# EAGLE schematic Main_Board (EAGLE 9.7.0)
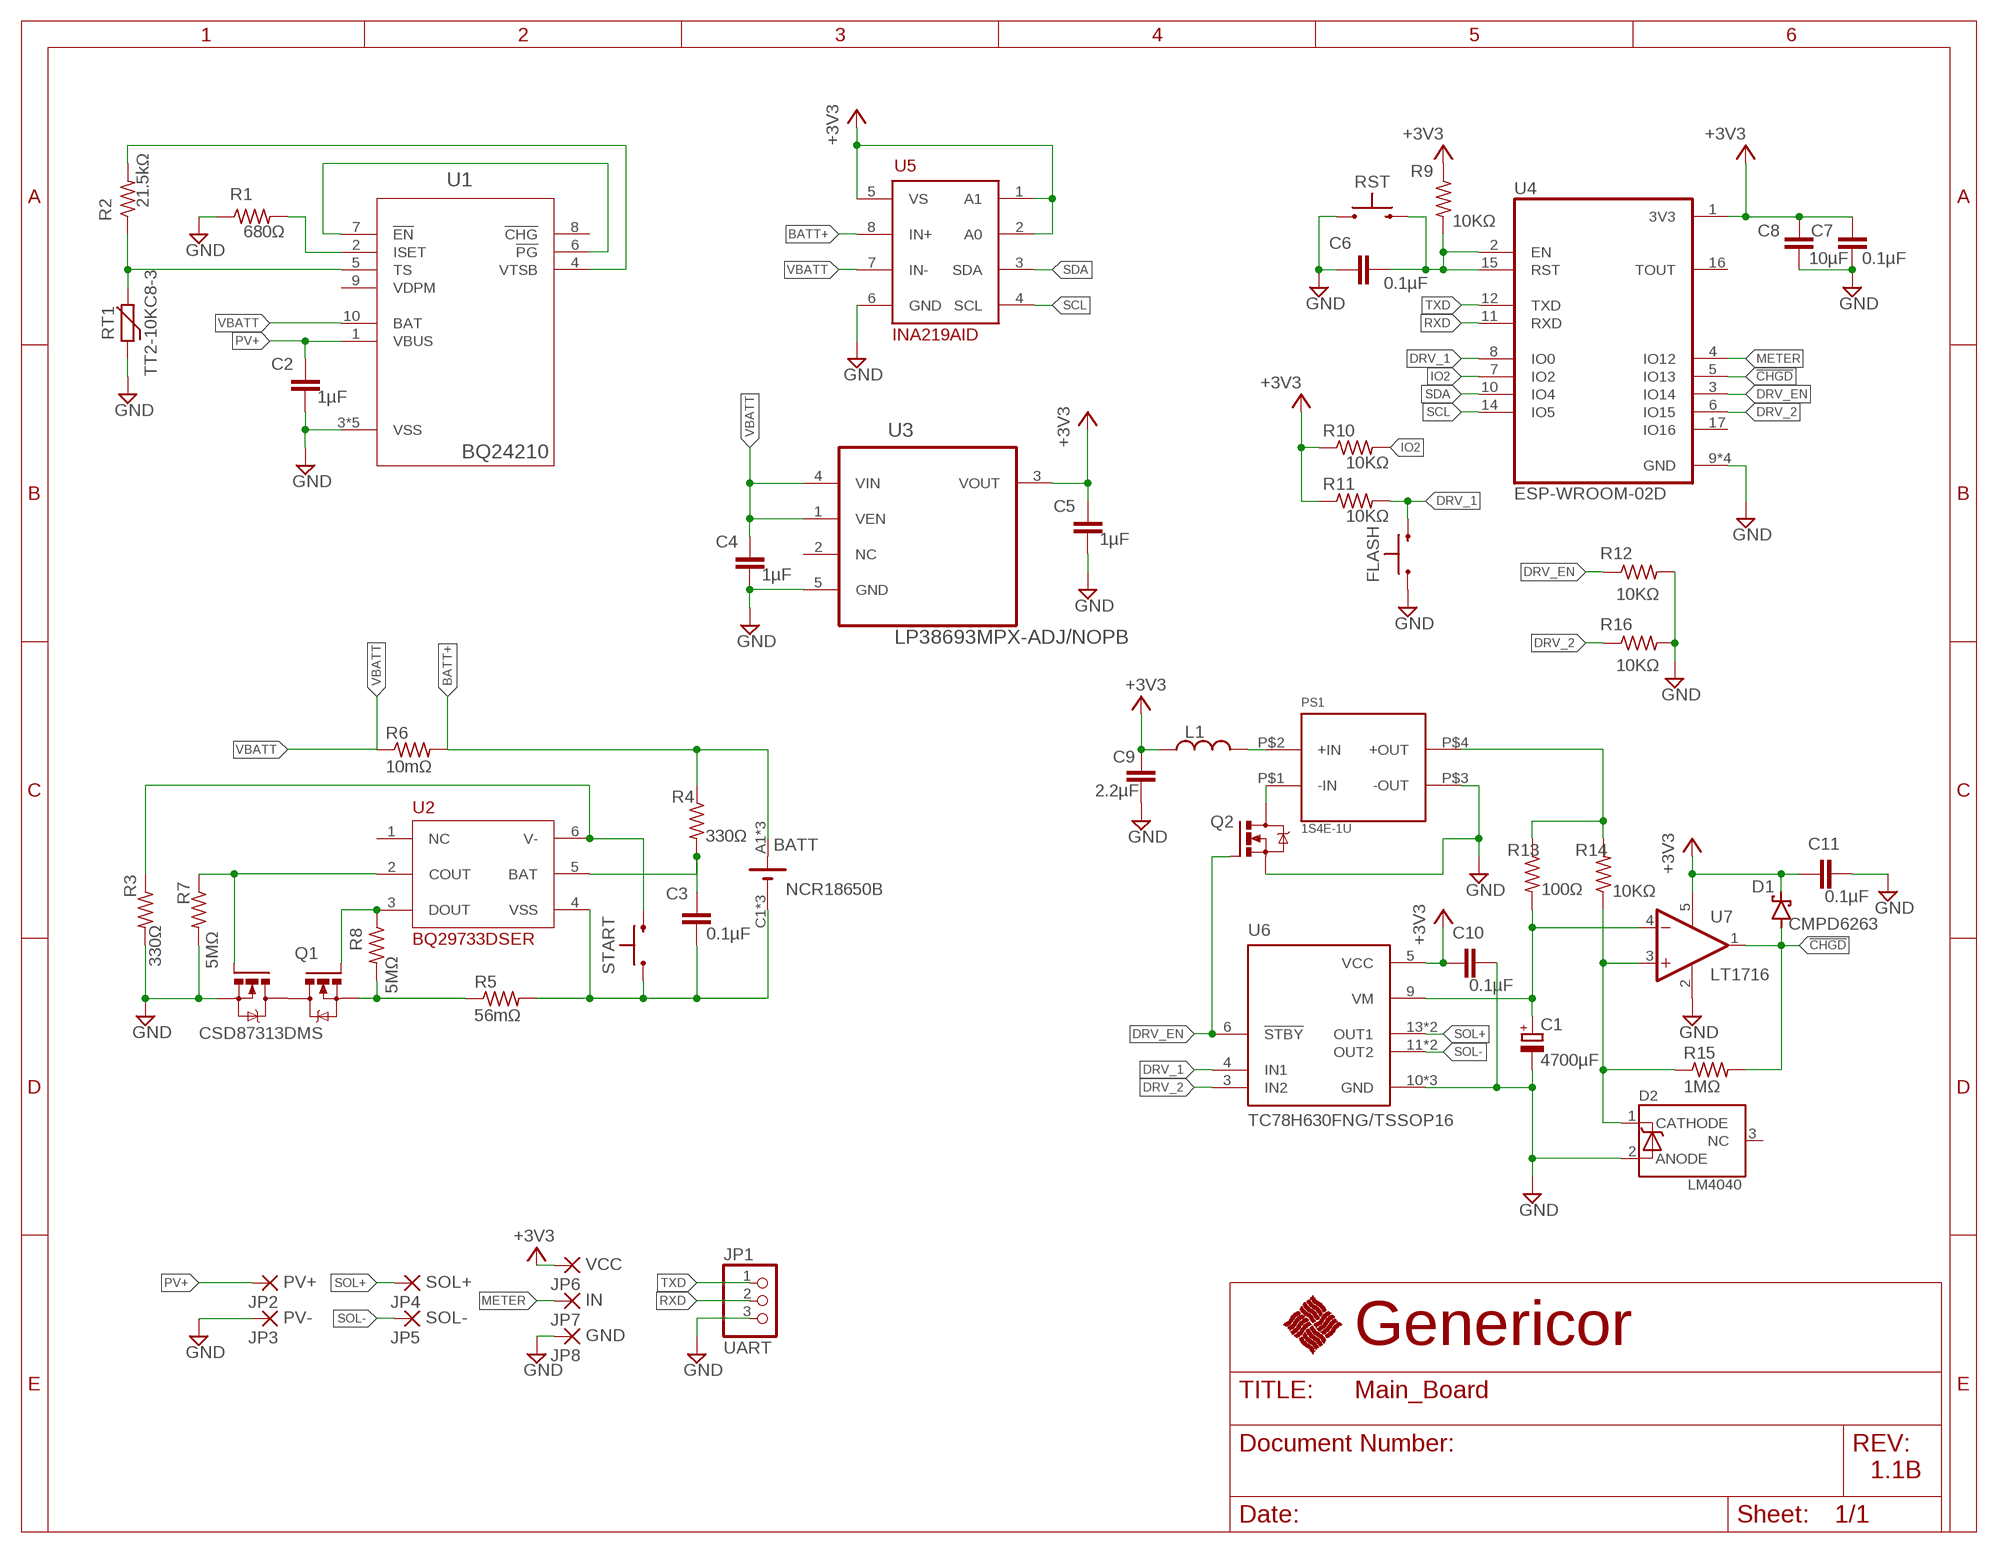
[diagram p0: schematic, sheet 1]

## Parts
BATT  NCR18650B  [18650-65MM-54-PTH]
C1  4700µF  CPOL-7.62-18-27  [E7,5-18]
C2  1µF  C-EUC0402  [C0402]
C3  0.1µF  C-EUC0402  [C0402]
C4  1µF  C-EUC0402  [C0402]
C5  1µF  C-EUC0402  [C0402]
C6  0.1µF  C-EUC0402  [C0402]
C7  0.1µF  C-EUC0402  [C0402]
C8  10µF  C-EUC0805  [C0805]
C9  2.2µF  C-EUC1210  [C1210]
C10  0.1µF  C-EUC0402  [C0402]
C11  0.1µF  C-EUC0402  [C0402]
D1  CMPD6263  [SOT95P227X109-3N]
D2  LM4040LM4040CIM3-8.2  [SOT95P240X110-3N]
FLASH  PTS636_SL43_SMTR_LFS  [S_43]
JP1  UART  PINHD-1X3  [1X03]
JP2  PV+  WIREPAD2,54/1,1  [2,54/1,1]
JP3  PV-  WIREPAD2,54/1,1  [2,54/1,1]
JP4  SOL+  WIREPAD2,54/1,1  [2,54/1,1]
JP5  SOL-  WIREPAD2,54/1,1  [2,54/1,1]
JP6  VCC  WIREPAD2,54/1,1  [2,54/1,1]
JP7  IN  WIREPAD2,54/1,1  [2,54/1,1]
JP8  GND  WIREPAD2,54/1,1  [2,54/1,1]
L1  ASPI-6045S-180M-T  [INDM6060X450N]
PS1  1S4E-1U  [1S4E_S1U-DIP4]
Q1  CSD87313DMS  [DMS0008A]
Q2  CSD16406Q3  [DQG0008A]
R1  680Ω  R-US_R0805  [R0805]
R2  21.5kΩ  R-US_R0805  [R0805]
R3  330Ω  R-US_R0805  [R0805]
R4  330Ω  R-US_R0805  [R0805]
R5  56mΩ  R-US_R0805  [R0805]
R6  10mΩ  R-US_R1206  [R1206]
R7  5MΩ  R-US_R0805  [R0805]
R8  5MΩ  R-US_R0805  [R0805]
R9  10KΩ  R-US_R0805  [R0805]
R10  10KΩ  R-US_R0805  [R0805]
R11  10KΩ  R-US_R0805  [R0805]
R12  10KΩ  R-US_R0805  [R0805]
R13  100Ω  R-US_R0805  [R0805]
R14  10KΩ  R-US_R0805  [R0805]
R15  1MΩ  R-US_R0805  [R0805]
R16  10KΩ  R-US_R0805  [R0805]
RST  PTS636_SL43_SMTR_LFS  [S_43]
RT1  TT2-10KC8-3  [THERMISTOR]
START  PTS636_SL43_SMTR_LFS  [S_43]
U1  BQ24210  [DQC10_P84X2P4]
U2  BQ29733DSER  [SON50P150X150X80-6N]
U3  LP38693MPX-ADJ/NOPB  [SOT150P700X180-5N]
U4  ESP-WROOM-02D  [MODULE_ESP-WROOM-02D]
U5  INA219AID  [SOIC127P599X175-8N]
U6  TC78H630FNG/TSSOP16  [TSSOP16]
U7  LT1716  [SOT95P280X100-5N]
U$2  GENERICORLOGO  [GENERICORLOGO]

## Nets
8.2VREF: D2.1(CATHODE) R14.1 R15.1 U7.3(IN+)
9V+: PS1.P$4(+OUT) R13.1 R14.2
!CHGD: D1.1(A) R15.2 U4.5(IO13) U7.1(OUT)
+3V3: C5.1 C7.1 C8.1 C9.1 C10.1 C11.1 D1.3(C) JP6.1(P) L1.1 R9.1 R10.1 R11.1 U3.3(VOUT) U4.1(3V3) U5.1(A1) U5.2(A0) U5.5(VS) U6.5(VCC) U7.5(V+)
BAT: C3.1 R4.2 U2.5(BAT)
BATT+: BATT.A1(+) BATT.A2(+) BATT.A3(+) R4.1 R6.2 U5.8(IN+)
BATT-: BATT.C1(-) BATT.C2(-) BATT.C3(-) C3.2 R5.2 START.A U2.4(VSS)
COUT: Q1.4(G2) R7.1 U2.2(COUT)
DOUT: Q1.1(G1) R8.1 U2.3(DOUT)
DRV_1: FLASH.C R11.2 U4.8(IO0) U6.4(IN1)
DRV_2: R16.1 U4.6(IO15) U6.3(IN2)
DRV_EN: Q2.4(G) R12.1 U4.3(IO14) U6.6(!STBY)
EN-RST: C6.1 R9.2 RST.C U4.2(EN) U4.15(RST)
GND: C1.- C2.2 C4.2 C5.2 C6.2 C7.2 C8.2 C9.2 C10.2 C11.2 D2.2(ANODE) FLASH.A JP1.3 JP3.1(P) JP8.1(P) PS1.P$3(-OUT) Q1.5(S2) Q1.6(S2) Q1.10(S2) Q2.1(S) Q2.2(S) Q2.3(S) R1.1 R3.2 R7.2 R12.2 R16.2 RST.A RT1.1 U1.3(VSS) U1.11(VSS) U1.V(VSS) U1.V_1(VSS) U1.V_2(VSS) U3.5(GND) U4.9(GND) U4.13(GND) U4.18(GND) U4.19(GND) U5.6(GND) U6.10(GND) U6.15(GND) U6.16(GND) U7.2(V-)
IO2: R10.2 U4.7(IO2)
ISET: R1.2 U1.2(ISET)
METER: JP7.1(P) U4.4(IO12)
PG-EN: U1.6(!PG) U1.7(!EN)
PS1+IN: L1.2 PS1.P$2(+IN)
PS1-IN: PS1.P$1(-IN) Q2.5(D) Q2.6(D) Q2.7(D) Q2.8(D) Q2.9(D)
PV+: C2.1 JP2.1(P) U1.1(VBUS)
Q1S1: Q1.7(S1) Q1.8(S1) Q1.9(S1) R5.1 R8.2
RXD: JP1.2 U4.11(RXD)
SCL: U4.14(IO5) U5.4(SCL)
SDA: U4.10(IO4) U5.3(SDA)
SOL+: JP4.1(P) U6.13(OUT1) U6.14(OUT1)
SOL-: JP5.1(P) U6.11(OUT2) U6.12(OUT2)
TS: R2.1 RT1.2 U1.5(TS)
TXD: JP1.1 U4.12(TXD)
V-: R3.1 START.C U2.6(V-)
VBATT: C4.1 R6.1 U1.10(BAT) U3.1(VEN) U3.4(VIN) U5.7(IN-)
VM: C1.+ R13.2 U6.9(VM) U7.4(IN-)
VTSB: R2.2 U1.4(VTSB)
Unconnected: D2.3(NC) Q1.2(D) Q1.3(D) U1.8(!CHG) U1.9(VDPM) U2.1(NC) U3.2(NC) U4.16(TOUT) U4.17(IO16)

## Notes on the sheet
- Genericor
- 1.1B

## Library data of the parts
BATT = Genericor Parts:NCR18650B
C1 = Genericor Parts:CPOL-7.62-18-27
C2-C11 = rcl:C-EU: CAPACITOR, European symbol; SPICEPREFIX: C
D1 = Genericor Parts:CMPD6263
D2 = Genericor Parts:LM4040: LM4040CIM3-8.2/NOPB 8.2V Shunt Voltage Reference IC; AVAILABILITY: In Stock; DESCRIPTION: Shunt Voltage Reference IC Fixed 8.192 V ±0.5% 15mA SOT-23-3; MF: Texas Instruments; MP: LM4040CIM3-8.2/NOPB; PACKAGE: SOT-23-3; PRICE: None; PURCHASE-URL: https://pricing.snapeda.com/search/part/LM4040/?ref=eda
FLASH RST START = Genericor Parts:PTS636_SL43_SMTR_LFS
JP1 = Connector:PINHD-1X3: PIN HEADER; CATEGORY: CONNECTOR; SUB-CATEGORY: PIN-HEADER
JP2-JP8 = wirepad:WIREPAD: Wire PAD connect wire on PCB
L1 = Genericor Parts:ASPI-6045S-180M-T
PS1 = Genericor Parts:1S4E-1U
Q1 = Genericor Parts:CSD87313DMS
Q2 = Genericor Parts:CSD16406Q3
R1-R16 = rcl:R-US_: RESISTOR, American symbol; SPICEPREFIX: R
RT1 = Genericor Parts:TT2-10KC8-3
U1 = Genericor Parts:BQ24210
U2 = Genericor Parts:BQ29733DSER: LiPo/LiIon Battery Protection IC WSOP-6; OCC: -0.100; OCC_DELAY: 8; OCD: 0.120; ODC_DELAY: 8; OVP: 4.400; OVP_DELAY: 1.25; SCD: 0.3; SCD_DELAY: 250; UVP: 2.800
U3 = Genericor Parts:LP38693MPX-ADJ/NOPB: Linear Regulators Check prices <https://pricing.snapeda.com/parts/LP38693MPX-ADJ/NOPB/Texas%20Instruments/view-part?ref=eda>
U4 = Genericor Parts:ESP-WROOM-02D: WiFi 802.11b/g/n Transceiver Module 2.4GHz ~ 2.5GHz Integrated, Trace Surface Mount Check prices <https://pricing.snapeda.com/parts/ESP-WROOM-02D/Espressif%20Systems/view-part?ref=eda>; AVAILABILITY: In Stock; DESCRIPTION: WiFi 802.11b/g/n Transceiver Module 2.4GHz ~ 2.5GHz Integrated, Trace Surface Mount; MF: Espressif Systems; MP: ESP-WROOM-02D; PACKAGE: SMD-18 Espressif Systems; PRICE: None; PURCHASE-URL: https://pricing.snapeda.com/search/part/ESP-WROOM-02D/?ref=eda
U5 = Genericor Parts:INA219AID
U6 = Genericor Parts:TC78H630FNG/TSSOP16: DC Brushed Motor Drivers IC; AVAILABILITY: Not in stock; DESCRIPTION: Motor Driver IC; MF: Toshiba; MP: TC78H630FNG; PACKAGE: TSSOP-16d; PRICE: None
U7 = Genericor Parts:LT1716
U$2 = Genericor Parts:GENERICORLOGO